# Altium schematic sheet USB_HUB.SchDoc
size A4; SheetNumber: 14; SheetTotal: 16
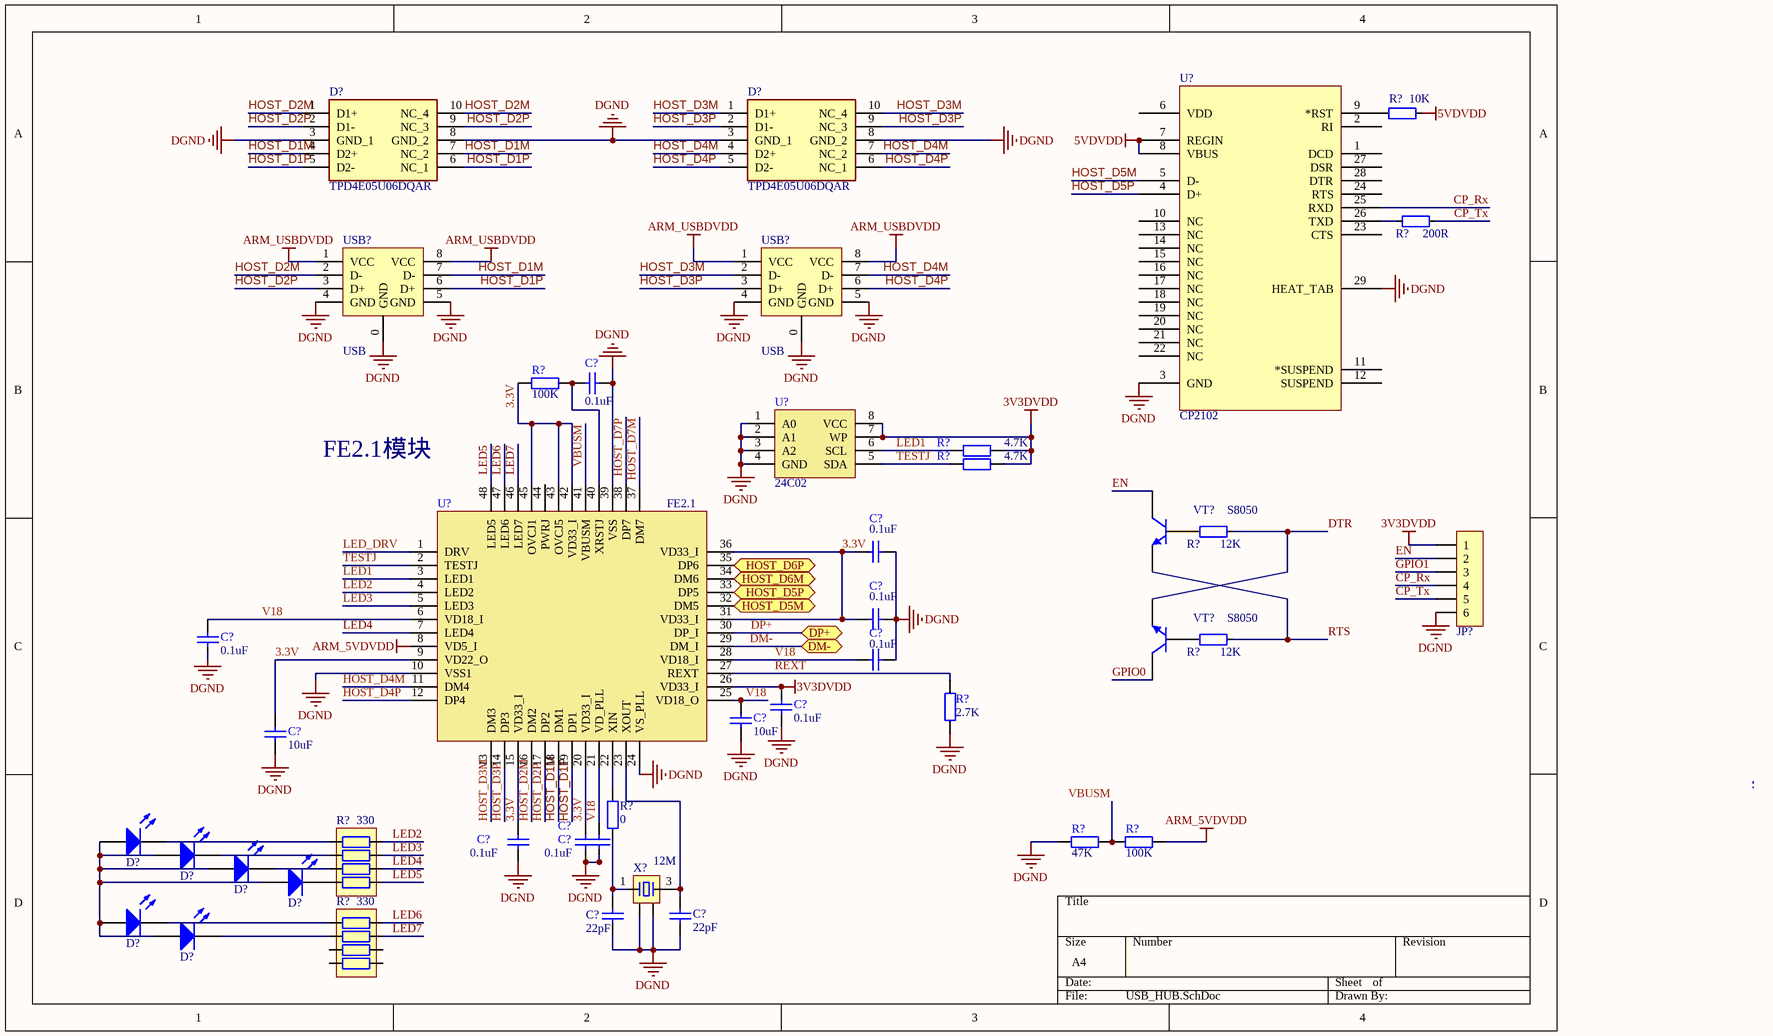
[diagram p0: USB_HUB.SchDoc]

## Parts
(Parts that share a designator on the sheet are numbered #1, #2 ... from top to bottom, then left to right.)
C?#1  0.1uF  [C 0603_L]
C?#2  0.1uF  [C 0603_L]
C?#3  0.1uF  [C 0603_L]
C?#4  0.1uF  [C 0603_L]
C?#5  0.1uF  [C 0603_L]
C?#6  0.1uF  [C 0603_L]
C?#7  10uF  [C 0603_L]
C?#8  10uF  [C 0603_L]
C?#9  0.1uF  [C 0603_L]
C?#10  0.1uF  [C 0603_L]
C?#11  0.1uF  [C 0603_L]  (value not drawn)
C?#12  22pF  [0603_C]
C?#13  22pF  [0603_C]
D?#1  TPD4E05U06DQAR  [DQA(R-PUSON-N10)]
D?#2  TPD4E05U06DQAR  [DQA(R-PUSON-N10)]
D?#3  LED  [LED_A1]  (value not drawn)
D?#4  LED  [LED_A1]  (value not drawn)
D?#5  LED  [LED_A1]  (value not drawn)
D?#6  LED  [LED_A1]  (value not drawn)
D?#7  LED  [LED_A1]  (value not drawn)
D?#8  LED  [LED_A1]  (value not drawn)
JP?  HDR-1X6  [XH2.54-WI-6P]  (value not drawn)
R?#1  10K  [RES_0402]
R?#2  200R  [RES_0402]
R?#3  100K  [0603]
R?#4  4.7K  [0603]
R?#5  4.7K  [0603]
R?#6  12K  [RES_0402]
R?#7  12K  [RES_0402]
R?#8  2.7K  [0603]
R?#9  47K  [0603]
R?#10  100K  [0603]
R?#11  330  [RCA-8P4R-0603]
R?#12  0  [R 0603_L]
R?#13  330  [RCA-8P4R-0603]
U?#1  CP2102  [QFN32 5x5_L]
U?#2  24C02  [SOP-8]
U?#3  FE2.1  [LQFP48 7X7_L]
USB?#1  USB  [USB A/2-17]
USB?#2  USB  [USB A/2-17]
VT?#1  S8050  [SMT_TRIODE_NPN]
VT?#2  S8050  [SMT_TRIODE_NPN]
X?  12M  [OSC 3225-4P]

## Ports
DM- (bidir), DP+ (bidir), HOST_D5M (bidir), HOST_D5P (bidir), HOST_D6M (bidir), HOST_D6P (bidir)

## Nets
3V3DVDD: C?#6.2 JP?.1 R?#4.1 R?#5.1 U?#2.7(WP) U?#2.8(VCC) U?#3.26(VD33_I)
5VDVDD: R?#1.1 U?#1.7(REGIN) U?#1.8(VBUS)
ARM_5VDVDD: R?#10.2 U?#3.8(VD5_I)
ARM_USBDVDD: USB?#1.1(VCC) USB?#1.8(VCC) USB?#2.1(VCC) USB?#2.8(VCC)
DGND: C?#1.1 C?#2.1 C?#3.1 C?#4.1 C?#5.1 C?#6.1 C?#7.1 C?#8.1 C?#9.1 C?#10.1 C?#11.1 C?#12.2 C?#13.2 D?#1.3(GND_1) D?#1.8(GND_2) D?#2.3(GND_1) D?#2.8(GND_2) JP?.6 R?#8.1 R?#9.1 U?#1.3(GND) U?#1.29(HEAT_TAB) U?#2.1(A0) U?#2.2(A1) U?#2.3(A2) U?#2.4(GND) U?#3.10(VSS1) U?#3.24(VS_PLL) U?#3.39(VSS) USB?#1.0(GND) USB?#1.4(GND) USB?#1.5(GND) USB?#2.0(GND) USB?#2.4(GND) USB?#2.5(GND) X?.2 X?.4
3.3V: C?#2.2 C?#3.2 C?#8.2 C?#9.2 C?#10.2 R?#3.1 U?#3.9(VD22_O) U?#3.15(VD33_I) U?#3.20(VD33_I) U?#3.31(VD33_I) U?#3.36(VD33_I) U?#3.42(VD33_I) U?#3.43(OVCJ5) U?#3.45(OVCJ1)
CP_Rx: JP?.4 U?#1.25(RXD)
CP_Tx: JP?.5 R?#2.1
DM-: U?#3.29(DM_I) ; port DM-
DP+: U?#3.30(DP_I) ; port DP+
DTR: R?#6.1 VT?#2.2(E)
EN: JP?.2 VT?#1.3(C)
GPIO0: VT?#2.3(C)
GPIO1: JP?.3
HOST_D1M: D?#1.4(D2+) D?#1.7(NC_2) U?#3.18(DM1) USB?#1.7(D-)
HOST_D1P: D?#1.5(D2-) D?#1.6(NC_1) U?#3.19(DP1) USB?#1.6(D+)
HOST_D2M: D?#1.1(D1+) D?#1.10(NC_4) U?#3.16(DM2) USB?#1.2(D-)
HOST_D2P: D?#1.2(D1-) D?#1.9(NC_3) U?#3.17(DP2) USB?#1.3(D+)
HOST_D3M: D?#2.1(D1+) D?#2.10(NC_4) U?#3.13(DM3) USB?#2.2(D-)
HOST_D3P: D?#2.2(D1-) D?#2.9(NC_3) U?#3.14(DP3) USB?#2.3(D+)
HOST_D4M: D?#2.4(D2+) D?#2.7(NC_2) U?#3.11(DM4) USB?#2.7(D-)
HOST_D4P: D?#2.5(D2-) D?#2.6(NC_1) U?#3.12(DP4) USB?#2.6(D+)
HOST_D5M: U?#3.32(DM5) ; port HOST_D5M
HOST_D5M: U?#1.5(D-)  [a separate net that carries the same name]
HOST_D5P: U?#3.33(DP5) ; port HOST_D5P
HOST_D5P: U?#1.4(D+)  [a separate net that carries the same name]
HOST_D6M: U?#3.34(DM6) ; port HOST_D6M
HOST_D6P: U?#3.35(DP6) ; port HOST_D6P
HOST_D7M: U?#3.37(DM7)
HOST_D7P: U?#3.38(DP7)
LED1: R?#4.2 U?#2.6(SCL) U?#3.3(LED1)
LED2: R?#11.8 U?#3.4(LED2)
LED3: R?#11.7 U?#3.5(LED3)
LED4: R?#11.6 U?#3.7(LED4)
LED5: R?#11.5 U?#3.48(LED5)
LED6: R?#13.8 U?#3.47(LED6)
LED7: R?#13.7 U?#3.46(LED7)
LED_DRV: U?#3.1(DRV)
REXT: R?#8.2 U?#3.27(REXT)
RTS: R?#7.1 VT?#1.2(E)
TESTJ: R?#5.2 U?#2.5(SDA) U?#3.2(TESTJ)
V18: C?#4.2 C?#5.2 C?#7.2 C?#11.2 U?#3.6(VD18_I) U?#3.21(VD_PLL) U?#3.25(VD18_O) U?#3.28(VD18_I)
VBUSM: R?#9.2 R?#10.1 U?#3.41(VBUSM)
NetC?#1_2: C?#1.2 R?#3.2 U?#3.40(XRSTJ)
NetC?#12_1: C?#12.1 R?#12.1 X?.1
NetC?#13_1: C?#13.1 U?#3.23(XOUT) X?.3
NetD?#3_1: D?#3.1(A) D?#4.1(A) D?#5.1(A) D?#6.1(A) D?#7.1(A) D?#8.1(A)
NetD?#3_2: D?#3.2(K) R?#11.1
NetD?#4_2: D?#4.2(K) R?#11.2
NetD?#5_2: D?#5.2(K) R?#11.3
NetD?#6_2: D?#6.2(K) R?#11.4
NetD?#7_2: D?#7.2(K) R?#13.1
NetD?#8_2: D?#8.2(K) R?#13.2
NetR?#1_2: R?#1.2 U?#1.9(*RST)
NetR?#2_2: R?#2.2 U?#1.26(TXD)
NetR?#6_2: R?#6.2 VT?#1.1(B)
NetR?#7_2: R?#7.2 VT?#2.1(B)
NetR?#12_2: R?#12.2 U?#3.22(XIN)

Not connected (* = marked no-connect by the designer): R?#13 3 4 5 6; U?#1 1(DCD) 2(RI) 6(VDD) 10(NC) 11(*SUSPEND) 12(SUSPEND) 13(NC) 14(NC) 15(NC) 16(NC) 17(NC) 18(NC) 19(NC) 20(NC) 21(NC) 22(NC) 23(CTS) 24(RTS) 27(DSR) 28(DTR); U?#3 44(PWRJ)

## Notes on the sheet
- FE2.1模块

## Library data of the parts
C?#1-C?#13 = Cap: Capacitor
  C?#1 C?#2 C?#5 C?#6 C?#10 C?#11: Published: 8-Jun-2000; LatestRevisionDate: 17-Jul-2002; LatestRevisionNote: Re-released for DXP Platform.; PackageReference: RAD-0.3; Publisher: Altium Limited
  C?#3 C?#4 C?#7-C?#9: Published: *; LatestRevisionDate: *; LatestRevisionNote: *; PackageReference: *; Publisher: *; Value: *
  C?#12 C?#13: Published: 8-Jun-2000; LatestRevisionDate: 17-Jul-2002; LatestRevisionNote: Re-released for DXP Platform.; PackageReference: RAD-0.3; Publisher: Altium Limited; Value: 22pF
D?#1 D?#2 = TPD4E05U06DQAR: Diode; Manufacturer_Name: Texas Instruments; Datasheet Link: http://www.ti.com/lit/gpn/tpd4e05u06; Manufacturer_Part_Number: TPD4E05U06DQAR; Mouser Part Number: 595-TPD4E05U06DQAR; Mouser Price/Stock: https://www.mouser.co.uk/ProductDetail/Texas-Instruments/TPD4E05U06DQAR?qs=%2FCrDlo5IrVPi4woOvWz0qA%3D%3D; Arrow Part Number: TPD4E05U06DQAR; Arrow Price/Stock: https://www.arrow.com/en/products/tpd4e05u06dqar/texas-instruments?region=nac
D?#3-D?#8 = LED: 发光二极管; 技术支持，联系售后: https://shop463601444.taobao.com
JP? = Header 6: 6P接插件; 版权归属: 封装库来自淘宝 ID：黄晶宝石; BOM名称: 6P接插件; 学习资源: https://shop463601444.taobao.com
R?#1 R?#2 R?#6 R?#7 = 电阻-0402: Resistor; Value: 22R
R?#3-R?#5 R?#8-R?#10 = Res2: Resistor
  R?#3 R?#9 R?#10: Published: 8-Jun-2000; LatestRevisionDate: 17-Jul-2002; LatestRevisionNote: Re-released for DXP Platform.; PackageReference: AXIAL-0.4; Publisher: Altium Limited
  R?#4 R?#5 R?#8: Published: *; LatestRevisionDate: *; LatestRevisionNote: *; PackageReference: *; Publisher: *; Value: *
R?#11 R?#13 = R-8P4R: 贴片排阻; BOM名称: 贴片网络排阻
R?#12 = R: 贴片电阻; 版权归属: 来自淘宝 ID：黄晶宝石; 封装库来自淘宝卖家 ID：黄晶宝石: 其他店铺购入均为盗版，不享受售后技术支持服务，请立即申请退款; BOM名称: 贴片电阻; 联系售后: https://shop463601444.taobao.com
U?#1 = CP2102: USB转TTL; PART DESC: SINGLE-CHIP USB TO UART BRIDGE, QFN28, RoHS.; MFG #1: SILICON LABS; PART NUMBER: CP2102; Value: Value; RefDes: RefDes; Type: DEV
U?#3 = F2.1
USB?#1 USB?#2 = USB-A/2: USB-A型双层母接口; BOM名称: USB-A型双层母接口; 学习资源: https://shop463601444.taobao.com
VT?#1 VT?#2 = SMT_TRIODE_NPN: Surface mount NPN transistor, package SOT-23
X? = XTAL-4P: 4脚无源晶振; 版权归属: 封装库来自淘宝卖家 ID：黄晶宝石; BOM名称: 4脚无源晶振; 学习资源: https://shop463601444.taobao.com